# Altium schematic sheet Differential Pair match spec.SchDoc
size A4
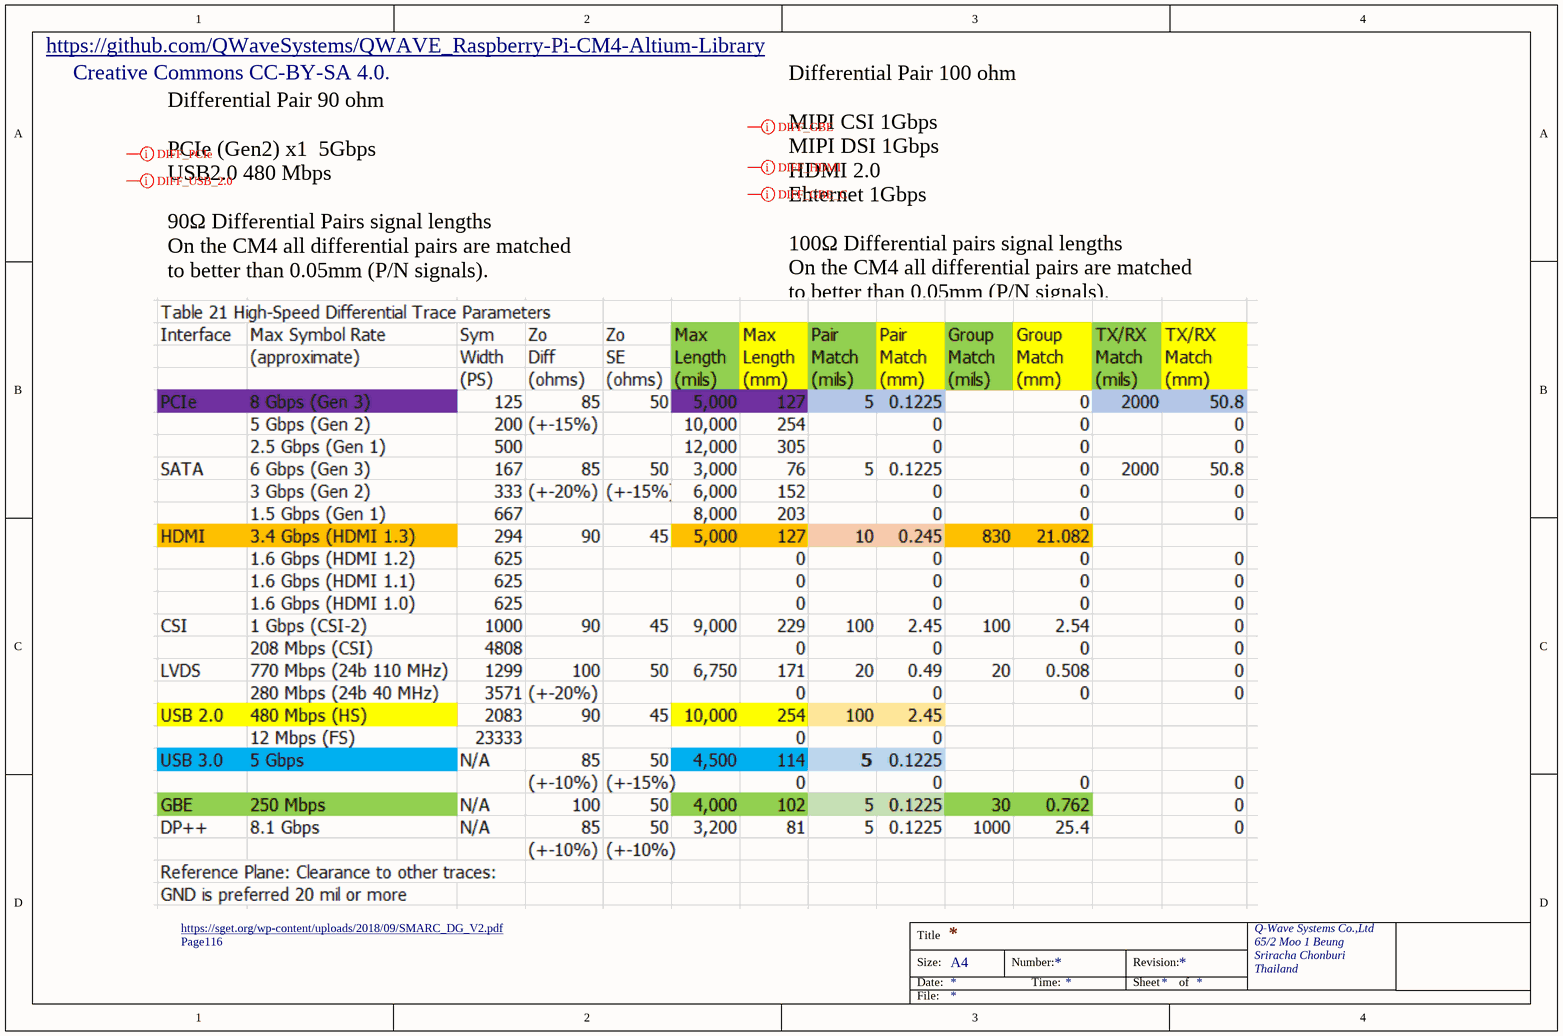
[diagram p0: Differential Pair match spec.SchDoc]

## Layout directives
differential pair; differential pair class DIFF_100Ohm_GBE; differential pair class DIFF_LAN_GB; net class GBE_1Gbps: (no net found under the mark)
differential pair; differential pair class DIFF_100Ohm_MIPI; differential pair class DIFF_MIPI; net class MIPI_1Gbps: (no net found under the mark)
differential pair; differential pair class DIFF_90Ohm_USB2.0; differential pair class DIFF_USB2.0; net class USB2.0_480Mbps: (no net found under the mark)
differential pair; differential pair class DIFF_90Ohm_PCIe; differential pair class DIFF_PCIe; net class PCIe_5Gbps: (no net found under the mark)
differential pair; differential pair class DIFF_100Ohm_HDMI; differential pair class DIFF_HDMI; net class HDMI_18Gbps: (no net found under the mark)

## Notes on the sheet
- https://github.com/QWaveSystems/QWAVE_Raspberry-Pi-CM4-Altium-Library
- Creative Commons CC-BY-SA 4.0.
- Differential Pair 90 ohm
  PCIe (Gen2) x1  5Gbps
  USB2.0 480 Mbps
  90Ω Differential Pairs signal lengths
  On the CM4 all differential pairs are matched to better than 0.05mm (P/N signals).
- Differential Pair 100 ohm
  MIPI CSI 1Gbps
  MIPI DSI 1Gbps
  HDMI 2.0
  Ehternet 1Gbps
  100Ω Differential pairs signal lengths
  On the CM4 all differential pairs are matched to better than 0.05mm (P/N signals).
- https://sget.org/wp-content/uploads/2018/09/SMARC_DG_V2.pdf
- Page116
- Title
- Size:
- Date:
- A4
- Number:
- Time:
- Revision:
- Sheet
- of
- Q-Wave Systems Co.,Ltd
- 65/2 Moo 1 Beung
- Sriracha Chonburi
- Thailand
- File: